# Altium schematic sheet PrechargeDischargeSch.SchDoc
size A; SheetNumber: 1; SheetTotal: 1
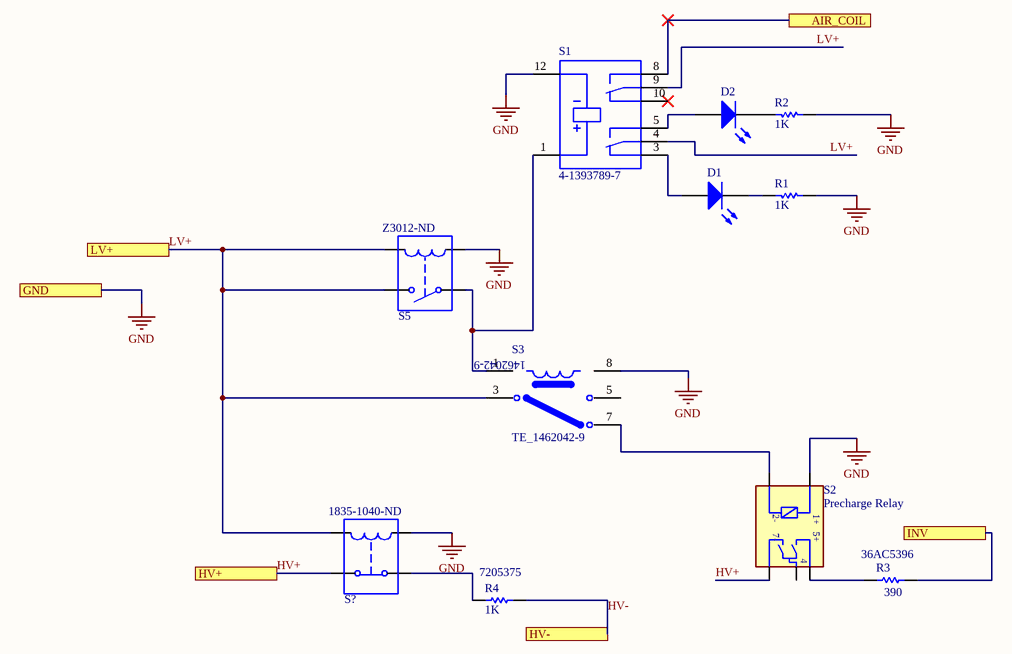
[diagram p0: PrechargeDischargeSch.SchDoc]

## Parts
D1  Light-Emitting Diode  (value not drawn)
D2  Light-Emitting Diode  (value not drawn)
R1  value 1K  (hidden comment: Resistor)
R2  value 1K  (hidden comment: Resistor)
R3  value 390  Supplier Part Number 1: 36AC5396  (hidden comment: Resistor)
R4  value 1K  Supplier Part Number 1: 7205375  (hidden comment: Resistor)
S1  4-1393789-7
S2  Precharge Relay  [RELAY_2-1904058-5]
S3  TE_1462042-9  [TE_1462042-9_0]
S5  Supplier Part Number 1: Z3012-ND  (hidden comment: Single-Pole,Single-Throw Normally Opened Relay)
S?  Supplier Part Number 1: 1835-1040-ND  [SPSTNC]  (hidden comment: Single-Pole,Single-Throw Normally Closed Relay)

## Ports
AIR_COIL, GND, HV+, HV-, INV, LV+

## Nets
GND: R1.2 R2.2 S1.12 S2.1(1+) S3.8 S5.3 S?.3 ; port GND
AIR_COIL: S1.8 ; port AIR_COIL
HV+: S2.7(7-) S?.2 ; port HV+
HV-: R4.2 ; port HV-
INV: R3.2 ; port INV
LV+: S1.4 S1.9 S3.3 S5.2 S5.4 S?.4 ; port LV+
NetD1_1: D1.1(A) S1.3
NetD1_2: D1.2(K) R1.1
NetD2_1: D2.1(A) S1.5
NetD2_2: D2.2(K) R2.1
NetR3_1: R3.1 S2.5(5+)
NetR4_1: R4.1 S?.1
NetS1_1: S1.1 S3.1 S5.1
NetS2_2: S2.2(2-) S3.7

Not connected (* = marked no-connect by the designer): S1 10*; S2 4; S3 5

## Notes on the sheet
- (in symbol TE_1462042-9) 1462042-9

## Library data of the parts
D1 D2 = LED: AF: 1; BV: 0; BV_MAX: 1e99; EG: 1.11; FC: 0.5; IBV: 0.001; IS: 1e-14; MJSW: 0.33; NTUN: 30; TNOM: 27; XTI: 3; SimulationGenericComponent: True; CJO: 0; CJP: 0; CTA: 0; CTP: 0; FCS: 0.5; FV_MAX: 1e99; IKF: 0; IKR: 0; ISR: 1e-14; JSW: 0; JTUN: 0; JTUNSW: 0; KEG: 1; KF: 0; LEVEL: 1; N: 1; NBV: 1; NR: 1; NS: 1; PHP: 1; RS: 0; TCV: 0; TLEV: 0; TLEVC: 0; TM1: 0; TM2: 0; TPB: 0; TPHP: 0; TRS: 0; TRS2: 0; TT: 0; TTT1: 0; TTT2: 0; VJ: 1; XTITUN: 3
R1 R2 = Resistor: TC1: 0; SimulationGenericComponent: True; TC2: 0
R3 = Resistor: TE CONNECTIVITY / CGS         HSA50390RJ             RESISTOR, ALU HOUSED, 390R, 5%, 50W; TC1: 0; SimulationGenericComponent: True; Temperature Coefficient: 30ppm/°C; Lead/Base Style: Fixed; Voltage Rating: 1.25kV; Number of Resistors: 1; TC2: 0; Supplier 1: Newark; Manufacturer: TE Connectivity; Manufacturer Part Number: HSA50390RJ; RoHS: Yes; Category: Wirewound Resistors; Stock 1: 2; Pricing 1: 1=5.61000, 10=5.46000, 25=5.27000, 50=4.71000, 100=4.29000, 250=3.86000 (USD); Mount: Chassis Mount; Housing Material: Aluminium; Min Operating Temperature: -55°C; Max Operating Temperature: 200°C; Tolerance: 5%; Power Rating: 50W; Resistance: 390R; Packaging: Tray; Package Quantity: 100; Termination: Solder; Resistor Type: Wirewound,Power resistor; Series: HS, CGS; Max Power Dissipation: 50W; Voltage Rating (DC): 1.25kV; Number of Terminations: 2; Technology: WIRE WOUND; Resistance Tolerance: 5%; Length: 51mm; Width: 30mm; Height: 17mm; RoHS Compliant: Yes; REACH SVHC: No SVHC; ELV: Compliant; ComponentLink1URL: https://datasheet.ciiva.com/11805/0900766b80ef190c-11805955.pdf?src-supplier=RSComponents; ComponentLink1Description: https://datasheet.ciiva.com/11805/0900766b80ef190c-11805955.pdf?src-supplier=RSComponents; ComponentLink2URL: https://datasheet.ciiva.com/12836/eng-ds-1773035-c-12836155.pdf?src-supplier=Mouser; ComponentLink2Description: https://datasheet.ciiva.com/12836/eng-ds-1773035-c-12836155.pdf?src-supplier=Mouser
R4 = Resistor: CGS - TE CONNECTIVITY - HSC1001K0J - WIREWOUND RESISTOR, 1KOHM, 100W, 5%; TC1: 0; SimulationGenericComponent: True; Voltage Rating: 1.9kV; Resistance: 1kR; Temperature Coefficient: 30ppm/°C; Lead/Base Style: Fixed; Number of Resistors: 1; TC2: 0; Supplier 1: RSComponents; Manufacturer: TE Connectivity; Manufacturer Part Number: HSC1001K0J; RoHS: Yes; Category: Resistors; Stock 1: 36; Pricing 1: 1=14.11800, 10=13.12400, 25=12.28500, 100=11.71100, 250=10.59200, 1=10.09000, 10=9.38000, 25=8.78000, 100=8.37000, 250=7.57000 (USD); Mount: Chassis Mount; Number of Pins: 2; Housing Material: Aluminium; Max Operating Temperature: 200°C; Tolerance: 5%; Power Rating: 100W; Resistor Type: Wirewound,Power resistor; Termination: Solder; Packaging: Tray; Series: HS, CGS; Max Power Dissipation: 100W; Voltage Rating (DC): 1.9kV; Number of Terminations: 2; Resistance Tolerance: 5%; Technology: WIRE WOUND; RoHS Compliant: Yes; REACH SVHC: Unknown; ELV: Compliant; ComponentLink1URL: https://datasheet.ciiva.com/11805/0900766b80ef190c-11805660.pdf?src-supplier=RSComponents; ComponentLink1Description: https://datasheet.ciiva.com/11805/0900766b80ef190c-11805660.pdf?src-supplier=RSComponents; ComponentLink2URL: https://datasheet.ciiva.com/7716/eng-ds-1773035-b-7716153.pdf?src-supplier=Element14; ComponentLink2Description: https://datasheet.ciiva.com/7716/eng-ds-1773035-b-7716153.pdf?src-supplier=Element14
S2 = 2-1904058-5: Electromechanical Relay 12VDC 50Ohm 20A SPST-NO-DM_25.55x20.7x19.3_mm THT Automotive Relay Automotive; MF: TE Connectivity; EU_RoHS_Compliance: Compliant; MP: 2-1904058-5; SnapEDA_Link: https://www.snapeda.com/parts/2-1904058-5/TE%20Connectivity%20Potter%20%26%20Brumfield%20Relays/view-part/2403564/?ref=snap; Digi-Key_Purchase_URL: https://www.digikey.com/product-detail/en/te-connectivity-potter-brumfield-relays/2-1904058-5/PB1975-ND/4168711?utm_source=snapeda&utm_medium=aggregator&utm_campaign=symbol; Package: None; TE_purchase_URL: https://www.te.com/usa-en/product-2-1904058-5.html?te_bu=Cor&te_type=disp&te_campaign=seda_glo_cor-seda-global-disp-prtnr-fy19-seda-model-bom-cta_sma-317_1&elqCampaignId=32493; Value: *; Digi-Key_Part_Number: PB1975-ND
S5 = SPST Relay NO: RELAY TIME DELAY 10MIN 3A 250V; Manufacturer: Omron; Manufacturer Part Number: H3FA-AU-DC12V; L_C: 1u; R_C: 100; RON: 1; ROFF: 1e12; ION: 1m; IOFF: 0; SimulationGenericComponent: True; Throw Configuration: DPST,SPST; Relay Type: Integrated; Coil Voltage (DC): 12V; Supplier 1: Digi-Key; RoHS: Yes; Category: Time Delay Relays; Stock 1: 80; Pricing 1: 1=82.21000, 10=77.88300, 25=73.55640, 50=69.22940, 100=64.90260 (USD); Mount: Through Hole; Number of Pins: 13; Weight: 15g; Min Operating Temperature: -10°C; Max Operating Temperature: 55°C; Package Quantity: 1; Max Current Rating: 3A; Termination: PC Pin; Max Voltage Rating (AC): 250V; Series: H3FA; ComponentLink1URL: https://datasheet.ciiva.com/2427/h3faseries-2427382.pdf?src-supplier=Digi-Key; ComponentLink1Description: https://datasheet.ciiva.com/2427/h3faseries-2427382.pdf?src-supplier=Digi-Key; ComponentLink2URL: https://datasheet.ciiva.com/15707/h3fa-ds-e-4-2-csm89-15707420.pdf?src-supplier=Onlinecomponents.com; ComponentLink2Description: https://datasheet.ciiva.com/15707/h3fa-ds-e-4-2-csm89-15707420.pdf?src-supplier=Onlinecomponents.com
S? = SPST Relay NC: Manufacturer: Comus; Manufacturer Part Number: 3350-4275-126; L_C: 1u; R_C: 100; RON: 1; ROFF: 1e12; ION: 1m; IOFF: 0; SimulationGenericComponent: True; Throw Configuration: SPST; Coil Type: Non-Latching; Coil Current: 68.6mA; Coil Voltage (DC): 12V; Contact Current Rating: 3A; Operate Time: 3ms; Coil Power: 823mW; Coil Resistance: 175R; Supplier 1: Digi-Key; RoHS: No; Category: Power Relays; Stock 1: 200; Pricing 1: 1=36.18000, 10=34.37100, 25=32.56200, 50=30.75300, 100=28.94400, 250=27.13500, 500=25.32600, 1000=24.42150 (USD); Mount: Through Hole; Min Operating Temperature: -20°C; Max Operating Temperature: 85°C; Packaging: Bulk; Release Time: 3ms; Termination: PC Pin; ComponentLink1URL: https://www.comus-intl.com/wp-content/uploads/2017/01/High-Voltage-Reed-Relays.pdf?src-supplier=Digi-Key; ComponentLink1Description: https://www.comus-intl.com/wp-content/uploads/2017/01/High-Voltage-Reed-Relays.pdf?src-supplier=Digi-Key